# Altium schematic sheet backup_Power.SchDoc: Power Supplies
size A3; DrawnBy: MAC; Project: FotoKite; DrwanWhen: Nov.2013; CheckedWhen: When?
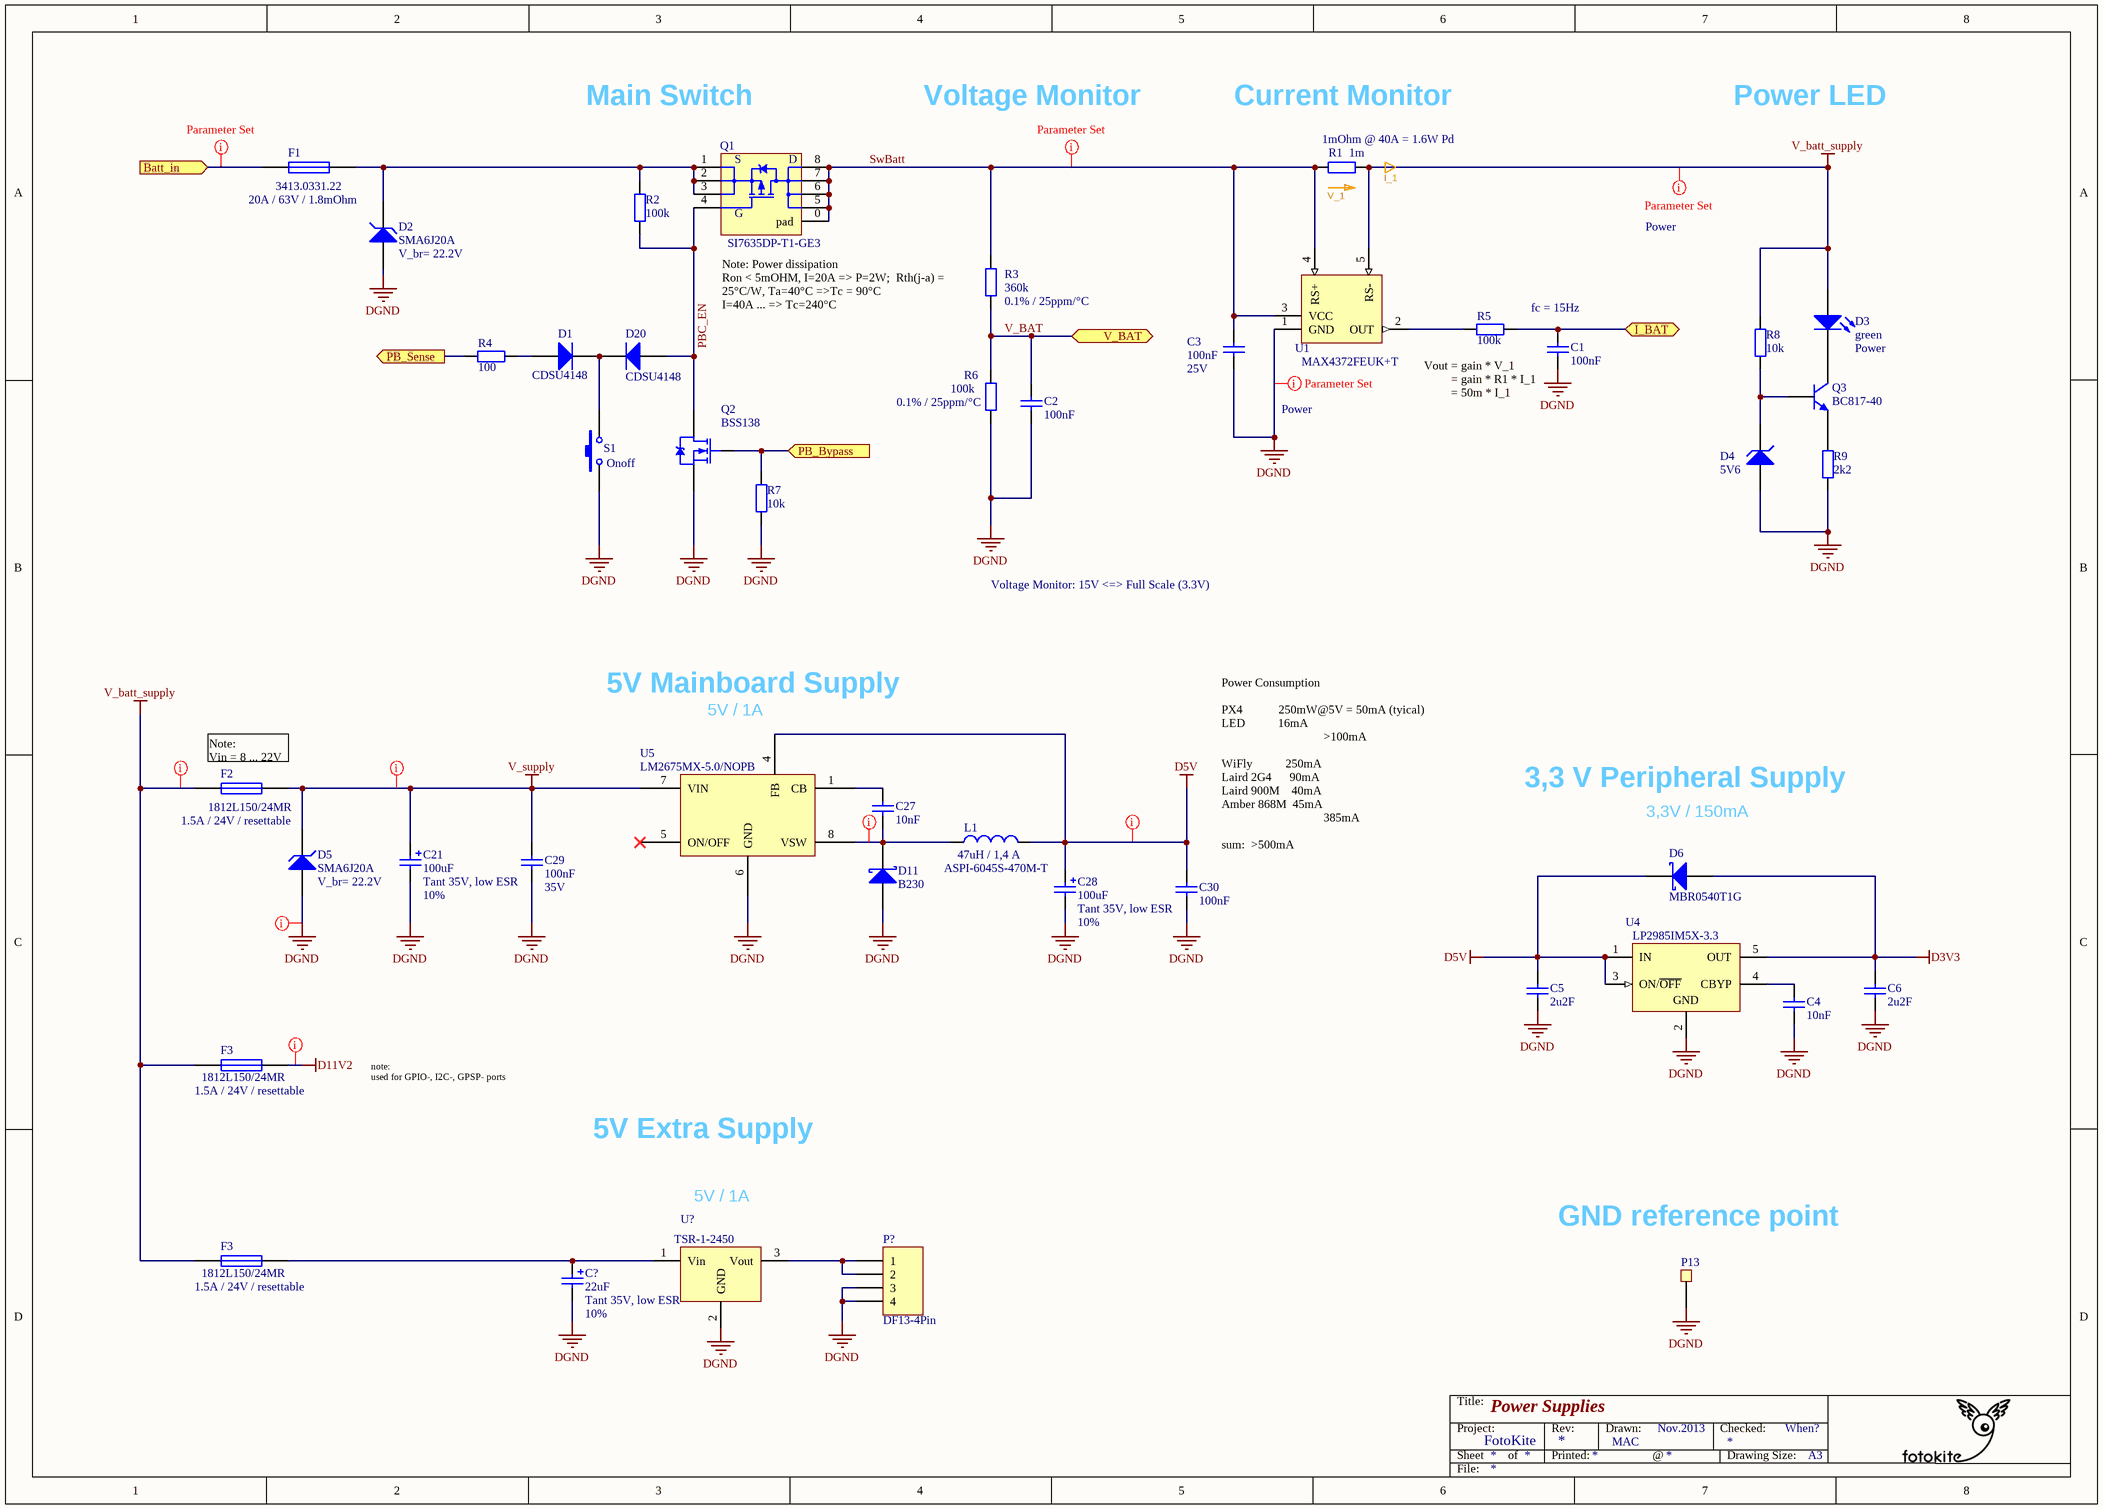
[diagram p0: backup_Power.SchDoc]

## Parts
(Parts that share a designator on the sheet are numbered #1, #2 ... from top to bottom, then left to right.)
*#1  Note: I_1  (hidden comment: arrow_Current)  (graphical)
*#2  Note: V_1  (hidden comment: arrow_Voltage)  (graphical)
C1  100nF  [CAP_0603i_1608m -N]
C2  100nF  [CAP_0603i_1608m -N]
C3  100nF  Note: 25V  [CAP_0603i_1608m -N]
C4  10nF  [CAP_0603i_1608m -N]
C5  2u2F  [CAP_0603i_1608m -N]
C6  2u2F  [CAP_0603i_1608m -N]
C21  100uF  Note: Tant 35V, low ESR  Tolerance: 10%  [EIA-7343-31 case D -N]
C27  10nF  [CAP_0603i_1608m -N]
C28  100uF  Note: Tant 35V, low ESR  Tolerance: 10%  [EIA-7343-31 case D -N]
C29  100nF  Note: 35V  [CAP_0603i_1608m -N]
C30  100nF  [CAP_0603i_1608m -N]
C?  22uF  Note: Tant 35V, low ESR  Tolerance: 10%  [EIA-7343-31 case D -N]
D1  CDSU4148  [SOD523F]
D2  SMA6J20A  Note: V_br= 22.2V  [Mini MELF - SOD-80 -N]
D3  Colour: green  [LED_0603i_1608m-n]  (hidden comment: Power)
D4  5V6  [Mini MELF - SOD-80 -N]
D5  SMA6J20A  Note: V_br= 22.2V  [Mini MELF - SOD-80 -N]
D6  MBR0540T1G  [SOD123]
D11  B230  [Diode SMB DO-214aa -N]
D20  CDSU4148  [SOD523F]
F1  3413.0331.22  Note: 20A / 63V / 1.8mOhm  [Fuse_1210i_3225m -N]
F2  1812L150/24MR  value 1.5A / 24V / resettable  [Fuse_1812i_4532m -N]
F3#1  1812L150/24MR  value 1.5A / 24V / resettable  [Fuse_1812i_4532m -N]
F3#2  1812L150/24MR  value 1.5A / 24V / resettable  [Fuse_1812i_4532m -N]
L1  ASPI-6045S-470M-T  value 47uH / 1,4 A  [ABRACON_ASPI-6045S]
P13  GND  [PIN1]  (value not drawn)
P?  DF13-4Pin  [Hirose_DF13_SMT_RA_N4]
Q1  SI7635DP-T1-GE3  [PowerPak SO-8]
Q2  BSS138  [SOT23-N]
Q3  BC817-40  [SOT23-N]
R1  1m  [RES_2512i_6332m -N]
R2  100k  [RES_0603i_1608m -N]
R3  360k  Tolerance: 0.1% / 25ppm/°C  [RES_0603i_1608m -N]
R4  100  [RES_0603i_1608m -N]
R5  100k  [RES_0603i_1608m -N]
R6  100k  Tolerance: 0.1% / 25ppm/°C  [RES_0603i_1608m -N]
R7  10k  [RES_0603i_1608m -N]
R8  10k  [RES_0603i_1608m -N]
R9  2k2  [RES_0603i_1608m -N]
S1  Note: Onoff  [EVQPU]  (hidden comment: EVQ-PUB02K)
U1  MAX4372FEUK+T  [MAXM-U5+1_N]
U4  LP2985IM5X-3.3  [MF05A_N]
U5  LM2675MX-5.0/NOPB  [SOIC127P600-8N]
U?  TSR-1-2450  [TST-1]

## Ports
Batt_in (in), I_BAT, PB_Bypass, PB_Sense, V_BAT

## Nets
D3V3: C6.2 D6.1(A) U4.5(OUT)
D5V: C5.2 C28.1 C30.2 D6.2(K) L1.2 U4.1(IN) U4.3(ON/~{OFF}) U5.4(FB)
D11V2: F3#1.2
DGND: C1.1 C2.1 C3.1 C4.1 C5.1 C6.1 C21.2 C28.2 C29.1 C30.1 C?.2 D2.1(A) D4.1(A) D5.1(A) D11.1(A) P13.1 P?.3 P?.4 Q2.2(S) R6.1 R7.1 R9.2 S1.2 U1.1(GND) U4.2(GND) U5.6(GND) U?.2(GND)
V_batt_supply: D3.1(A) F2.1 F3#1.1 F3#2.1 R1.2 R8.1 U1.5(RS-)
V_supply: C21.1 C29.2 D5.2(K) F2.2 U5.7(VIN)
Batt_in: F1.1 ; port Batt_in
I_BAT: C1.2 R5.2 ; port I_BAT
PB_Bypass: Q2.1(G) R7.2 ; port PB_Bypass
PB_Sense: R4.2 ; port PB_Sense
PBC_EN: D20.1(A) Q1.4(G) Q2.3(D) R2.1
SwBatt: C3.2 Q1.0(pad) Q1.5(D) Q1.6(D) Q1.7(D) Q1.8(D) R1.1 R3.2 U1.3(VCC) U1.4(RS+)
V_BAT: C2.2 R3.1 R6.2 ; port V_BAT
NetC4_2: C4.2 U4.4(CBYP)
NetC27_1: C27.1 D11.2(K) L1.1 U5.8(VSW)
NetC27_2: C27.2 U5.1(CB)
NetC?_1: C?.1 F3#2.2 U?.1(Vin)
NetD1_1: D1.1(A) R4.1
NetD1_2: D1.2(K) D20.2(K) S1.1
NetD2_2: D2.2(K) F1.2 Q1.1(S) Q1.2(S) Q1.3(S) R2.2
NetD3_2: D3.2(K) Q3.3(C)
NetD4_2: D4.2(K) Q3.1(B) R8.2
NetP?_1: P?.1 P?.2 U?.3(Vout)
NetQ3_2: Q3.2(E) R9.1
NetR5_1: R5.1 U1.2(OUT)

Not connected (* = marked no-connect by the designer): U5 5(ON/OFF)*

## Layout directives
net class Power: Batt_in, D5V, D11V2, DGND, NetC27_1, V_batt_supply, V_supply
rule Width Constraint [Pref Width = 25mil    Min Width = 10mil    Max Width = 200mil]; net class Power: SwBatt

## Notes on the sheet
- Main Switch
- Voltage Monitor
- Current Monitor
- Power LED
- 1mOhm @ 40A = 1.6W Pd
- Note: Power dissipation
  Ron < 5mOHM, I=20A => P=2W;  Rth(j-a) = 25°C/W, Ta=40°C =>Tc = 90°C
  I=40A ... => Tc=240°C
- fc = 15Hz
- (near C1) Vout = gain * V_1
  = gain * R1 * I_1
  = 50m * I_1
- Voltage Monitor: 15V <=> Full Scale (3.3V)
- 5V Mainboard Supply
- 5V / 1A
- (near F2) Note:
  Vin = 8 ... 22V
- 3,3 V Peripheral Supply
- 3,3V / 150mA
- (near C30) Power Consumption
  PX4            250mW@5V = 50mA (tyical)
  LED           16mA
  >100mA
  WiFly           250mA
  Laird 2G4      90mA
  Laird 900M    40mA
  Amber 868M  45mA
  385mA
  sum:  >500mA
- note:
  used for GPIO-, I2C-, GPSP- ports
- 5V Extra Supply
- (near P13) GND reference point
- Sheet
- Project:
- Title:
- of
- Rev:
- Printed:
- Drawn:
- @
- Checked:
- Drawing Size:
- A3
- File:

## Library data of the parts
C1-C6 C27 C29 C30 = Cap: capacitor
C21 C28 C? = Cap pol: Polarised capacitor (e.g. Electrolytic )
D1 D20 = Diode: Default Diode; Supplier: digikey: 641-1001-1-ND
D2 = Diode Zener: Zener Diode; Manufacturer ID: STM: SMA6J20A-TR; Supplier: digi-key: 497-5925-1-ND
D3 = Diode LED: LED; Comment:: Power; Supplier: Digikey: 475-2709-1-ND
D4 D5 = Diode Zener: Zener Diode
  D4: Supplier: digi-key: TZMC5V6-GS08CT-ND
  D5: Manufacturer ID: SMA6J20A; Supplier: digi-key: 497-5925-2-ND or similar
D6 = Diode  Schottky: Schottky Diode; Supplier: digi-key: MBR0540T1GOSCT-ND
D11 = Diode  Schottky: Schottky Diode; Manufacturer ID: Diodes Inc: B230-13-F; Note: Alternative: SS24/1; Supplier: digi-key: B230-FDICT-ND
F1 = Fuse: Manufacturer ID: Schurter: 3413.0331.22; Supplier: digi-key; 486-1689-1-ND
F2 F3#1 F3#2 = Fuse: Manufacturer ID: little fuse: 1812L150/24MR; Supplier: digi-key: F3487CT-ND
L1 = Inductor: Supplier: digi-key: ASPI-6045S-470M-TCT-ND
P13 = Pad: Single Pad or Testpoint
P? = DF13-4Pin: Hirose_DF13_SMT_RA_N4
Q1 = MOSFET-P-Power_2: Power P-Channel MOSFET + pad; Note: Check footprint as it may  differ; Supplier: digikey: SI7635DP-T1-GE3CT-ND
Q2 = MOSFET-N2: N-Channel MOSFET; Note: Check footprint as it may  differ; Supplier: digikey: BSS138CT-ND
Q3 = BJT NPN: NPN Bipolar Transistor; Note: Check footprint as it may  differ; Supplier: digi-key: 	568-1631-1-ND
R1 = Res: Resistor; Tolerance: 1%/50ppm/°C; Supplier: Digikey: CSNL20.001FRCT-ND
R2 R4 R5 R7-R9 = Res: Resistor
R3 = Res: Resistor; Note: digikey: A103088CT-ND
R6 = Res: Resistor; Note: digikey:RG16P100KBCT-ND
S1 = SW PB: Switch; Manufacturer ID: Panasonic: EVQ-PUB02K; Supplier: digi-key: P10848SCT-ND
U1 = CMP-0252-00304-1: Micropower, Voltage-Output, High-Side, Current-Sense Amplifier, 50 V / V Gain, -40 to 85 degC, 5-Pin SOT23 (U5+1), Pb-Free, Tape and Reel; Bi-Dir. Curr. Sense: No; Gain: 20 V/V, 50 V/V ,100 V/V; ComponentLink1Description: Manufacturer URL; ComponentLink3URL: http://pdfserv.maximintegrated.com/package_dwgs/21-0057.PDF; ComponentLink2URL: http://datasheets.maximintegrated.com/en/ds/MAX4372-MAX4372T.pdf; PackageDescription: 5-Pin Small-Outline Transistor Package (U5+1), Body 2.90 x 1.625 mm, Pitch 0.95 mm; Code_JEDEC: MO178; ComponentLink1URL: http://www.maximintegrated.com/; ComponentLink3Description: Package Specification; PackageVersion: Rev. G, 04/2011; DatasheetVersion: Rev. 5; PackageReference: U5+1; Mounting Technology: Surface Mount; PartNumber: MAX4372FEUK+T; ComponentLink2Description: Datasheet; supplier: digi-key: MAX4372FEUK+TCT-ND
U4 = CMP-0062-01952-2: Micropower 150 mA Low-Noise Ultra Low-Dropout Regulator, 5-pin SOT-23; Manufacturer: National Semiconductor; CompType: LDO IC; PackageTopMarking: L0RB*XTT; PowerWise: N; DatasheetVersion: Jul-2007; RoHS: N; ComponentLink2URL: http://www.national.com/pf/LP/LP2985.html; PackageReference: MF05A; PackageVersion: revD, Aug-2008; RevisionNote: Component URLs added; PinCount: 5; ComponentLink3Description: MF05A Package Page; PackageDescription: Molded SOT-23, .115 x .063 x .040 in Body, 5 Lead, .0375 in Pitch; ComponentLink2Description: LP2985 Web Page; ComponentLink1Description: LP2985 Datasheet; ComponentLink3URL: http://www.national.com/packaging/folders/mf05a.html; ComponentLink1URL: http://www.national.com/ds/LP/LP2985.pdf; supplier: digi-key: 296-18479-1-ND
U5 = LM2675: IC REG SIMPLE SWITCHER 8-SOIC; Manufacturer ID: National Semi:  LM2675M-5.0/NOPB-ND; Rating: 1A; Value: 5V / 1A; operationg voltage: 6.5 - 40V; Supplier: digi-key: LM2675M-5.0/NOPB-ND
U? = TSR-1-24xx: DC/DC Converter; different Voltages; 1A; Traco